# Altium schematic sheet Sheet1.SchDoc
size A4; SheetNumber: 1; SheetTotal: 1
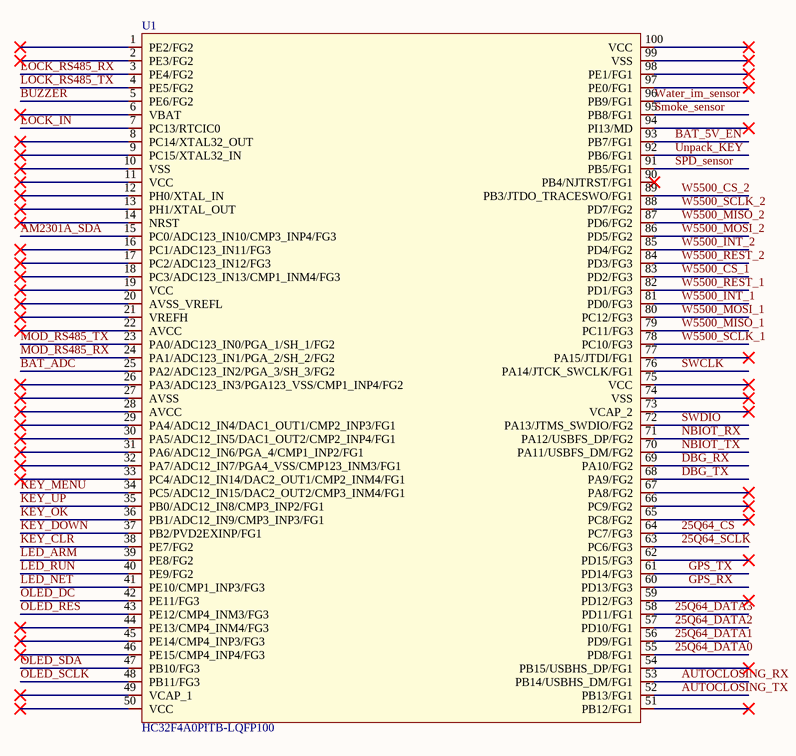
[diagram p0: Sheet1.SchDoc]

## Parts
U1  HC32F4A0PITB-LQFP100  [LQFP-100_L14.0-W14.0-P0.50-LS16.0-BL]

## Nets
25Q64_CS: U1.64(PC7/FG3)
25Q64_DATA0: U1.55(PD8/FG1)
25Q64_DATA1: U1.56(PD9/FG1)
25Q64_DATA2: U1.57(PD10/FG1)
25Q64_DATA3: U1.58(PD11/FG1)
25Q64_SCLK: U1.63(PC6/FG3)
AM2301A_SDA: U1.15(PC0/ADC123_IN10/CMP3_INP4/FG3)
AUTOCLOSING_RX: U1.53(PB14/USBHS_DM/FG1)
AUTOCLOSING_TX: U1.52(PB13/FG1)
BAT_5V_EN: U1.93(PB7/FG1)
BAT_ADC: U1.25(PA2/ADC123_IN2/PGA_3/SH_3/FG2)
BUZZER: U1.5(PE6/FG2)
DBG_RX: U1.69(PA10/FG2)
DBG_TX: U1.68(PA9/FG2)
GPS_RX: U1.60(PD13/FG3)
GPS_TX: U1.61(PD14/FG3)
KEY_CLR: U1.38(PE7/FG2)
KEY_DOWN: U1.37(PB2/PVD2EXINP/FG1)
KEY_MENU: U1.34(PC5/ADC12_IN15/DAC2_OUT2/CMP3_INM4/FG1)
KEY_OK: U1.36(PB1/ADC12_IN9/CMP3_INP3/FG1)
KEY_UP: U1.35(PB0/ADC12_IN8/CMP3_INP2/FG1)
LED_ARM: U1.39(PE8/FG2)
LED_NET: U1.41(PE10/CMP1_INP3/FG3)
LED_RUN: U1.40(PE9/FG2)
LOCK_IN: U1.7(PC13/RTCIC0)
LOCK_RS485_RX: U1.3(PE4/FG2)
LOCK_RS485_TX: U1.4(PE5/FG2)
MOD_RS485_RX: U1.24(PA1/ADC123_IN1/PGA_2/SH_2/FG2)
MOD_RS485_TX: U1.23(PA0/ADC123_IN0/PGA_1/SH_1/FG2)
NBIOT_RX: U1.71(PA12/USBFS_DP/FG2)
NBIOT_TX: U1.70(PA11/USBFS_DM/FG2)
OLED_DC: U1.42(PE11/FG3)
OLED_RES: U1.43(PE12/CMP4_INM3/FG3)
OLED_SCLK: U1.48(PB11/FG3)
OLED_SDA: U1.47(PB10/FG3)
Smoke_sensor: U1.95(PB8/FG1)
SPD_sensor: U1.91(PB5/FG1)
SWCLK: U1.76(PA14/JTCK_SWCLK/FG1)
SWDIO: U1.72(PA13/JTMS_SWDIO/FG2)
Unpack_KEY: U1.92(PB6/FG1)
W5500_CS_1: U1.83(PD2/FG3)
W5500_CS_2: U1.89(PB3/JTDO_TRACESWO/FG1)
W5500_INT_1: U1.81(PD0/FG3)
W5500_INT_2: U1.85(PD4/FG2)
W5500_MISO_1: U1.79(PC11/FG3)
W5500_MISO_2: U1.87(PD6/FG2)
W5500_MOSI_1: U1.80(PC12/FG3)
W5500_MOSI_2: U1.86(PD5/FG2)
W5500_REST_1: U1.82(PD1/FG3)
W5500_REST_2: U1.84(PD3/FG3)
W5500_SCLK_1: U1.78(PC10/FG3)
W5500_SCLK_2: U1.88(PD7/FG2)
Water_im_sensor: U1.96(PB9/FG1)

Not connected (* = marked no-connect by the designer): U1 1(PE2/FG2)* 2(PE3/FG2)* 6(VBAT)* 8(PC14/XTAL32_OUT)* 9(PC15/XTAL32_IN)* 10(VSS)* 11(VCC)* 12(PH0/XTAL_IN)* 13(PH1/XTAL_OUT)* 14(NRST)* 16(PC1/ADC123_IN11/FG3)* 17(PC2/ADC123_IN12/FG3)* 18(PC3/ADC123_IN13/CMP1_INM4/FG3)* 19(VCC)* 20(AVSS_VREFL)* 21(VREFH)* 22(AVCC)* 26(PA3/ADC123_IN3/PGA123_VSS/CMP1_INP4/FG2)* 27(AVSS)* 28(AVCC)* 29(PA4/ADC12_IN4/DAC1_OUT1/CMP2_INP3/FG1)* 30(PA5/ADC12_IN5/DAC1_OUT2/CMP2_INP4/FG1)* 31(PA6/ADC12_IN6/PGA_4/CMP1_INP2/FG1)* 32(PA7/ADC12_IN7/PGA4_VSS/CMP123_INM3/FG1)* 33(PC4/ADC12_IN14/DAC2_OUT1/CMP2_INM4/FG1)* 44(PE13/CMP4_INM4/FG3)* 45(PE14/CMP4_INP3/FG3)* 46(PE15/CMP4_INP4/FG3)* 49(VCAP_1)* 50(VCC)* 51(PB12/FG1)* 54(PB15/USBHS_DP/FG1)* 59(PD12/FG3)* 62(PD15/FG3)* 65(PC8/FG2)* 66(PC9/FG2)* 67(PA8/FG2)* 73(VCAP_2)* 74(VSS)* 75(VCC)* 77(PA15/JTDI/FG1)* 90(PB4/NJTRST/FG1)* 94(PI13/MD)* 97(PE0/FG1)* 98(PE1/FG1)* 99(VSS)* 100(VCC)*

## Library data of the parts
U1 = HC32F4A0PITB-LQFP100: Manufacturer: XHSC(小华); Add into BOM: yes; Symbol: HC32F4A0PITB-LQFP100; Device: HC32F4A0PITB-LQFP100; LCSC Part Name: HC32F4A0PITB-LQFP100; Supplier Part: C963558; Manufacturer Part: HC32F4A0PITB-LQFP100; Supplier Footprint: LQFP-100(14*14); JLCPCB Part Class: Extended Part; Datasheet: https://atta.szlcsc.com/upload/public/pdf/source/20201204/C963555_DB92D2F872D9C8AB844EAB737B57DFF6.pdf; Supplier: LCSC; Convert to PCB: yes